# EAGLE design Mozard (EAGLE 9.1.1)
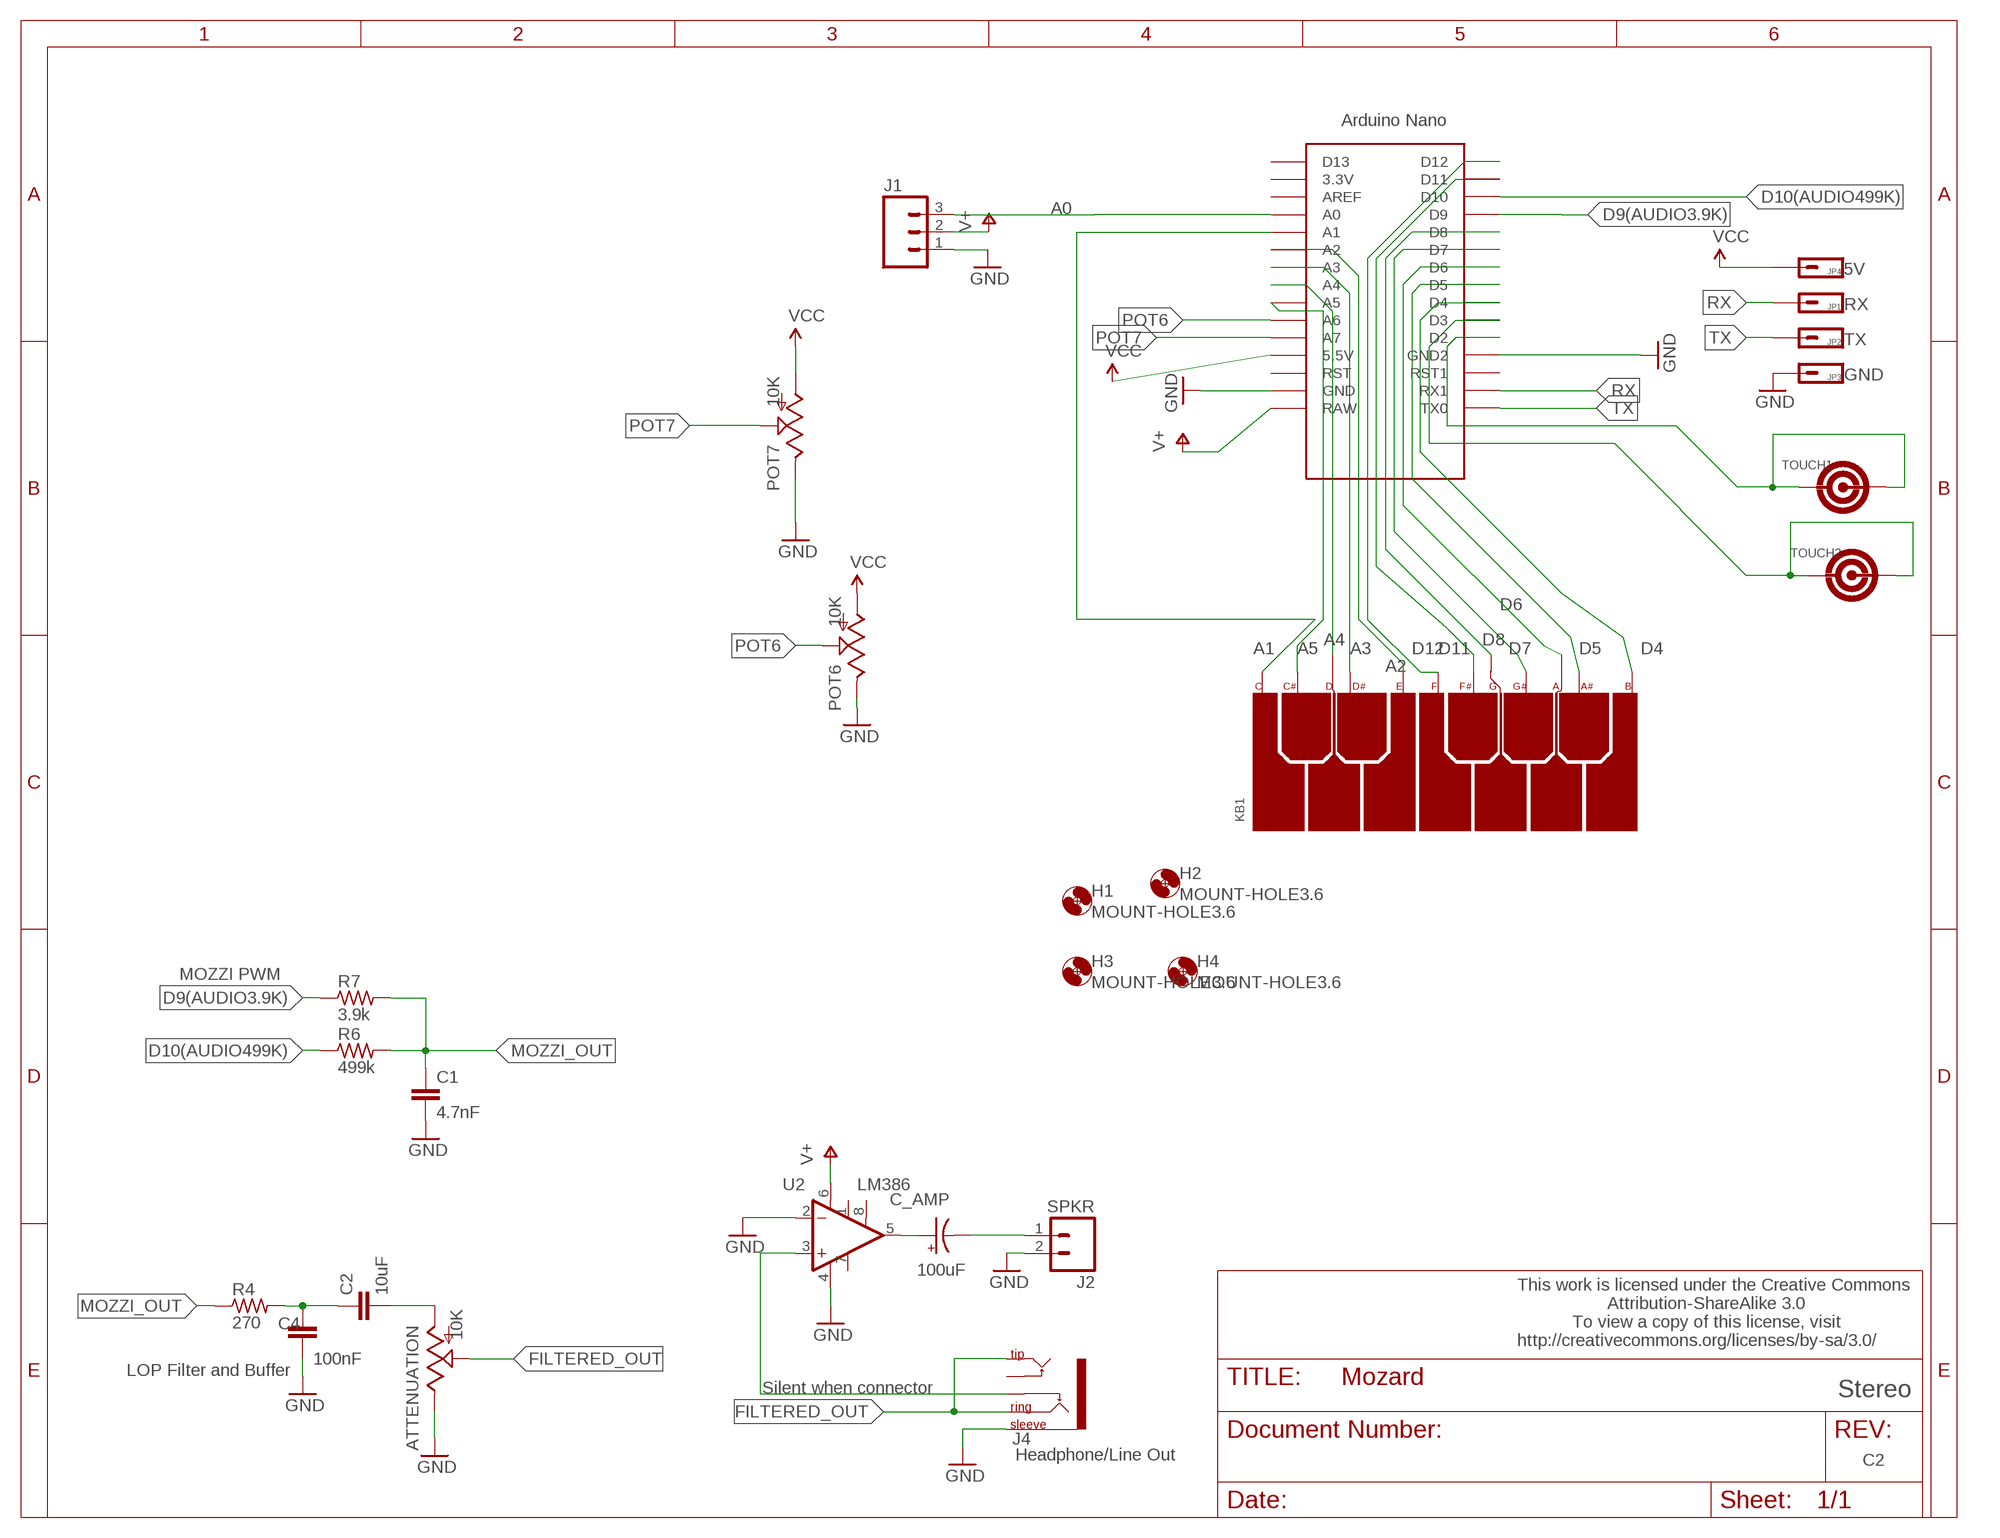
[diagram p0: schematic, sheet 1]

## Parts
ATTENUATION  10K  POTALPS-KIT  [ALPS_POT_KIT]
C1  4.7nF  0.1UF-50V-20%(PTH)KIT-EZ  [CAP-PTH-SMALL-KIT]
C2  10uF  0.1UF-50V-20%(PTH)KIT-EZ  [CAP-PTH-SMALL-KIT]
C4  100nF  0.1UF-50V-20%(PTH)KIT-EZ  [CAP-PTH-SMALL-KIT]
C_AMP  100uF  CPOL-RADIAL-10UF-25V  [CPOL-RADIAL-10UF-25V]
H1  MOUNT-HOLE3.6  [3,6]
H2  MOUNT-HOLE3.6  [3,6]
H3  MOUNT-HOLE3.6  [3,6]
H4  MOUNT-HOLE3.6  [3,6]
J1  M03SCREW  [SCREWTERMINAL-3.5MM-3]
J2  SPKR  M023.5MM  [SCREWTERMINAL-3.5MM-2]
J4  Headphone/Line Out  AUDIO-JACKPTH  [AUDIO-JACK]
JP1  RX  HEADER-1X1  [1X01_SIDE_NAME]
JP2  TX  HEADER-1X1  [1X01_SIDE_NAME]
JP3  GND  HEADER-1X1  [1X01_SIDE_NAME]
JP4  5V  HEADER-1X1  [1X01_SIDE_NAME]
KB1  PCB-KEYBOARD4  [PCB-KEYBOARD4]
POT6  10K  POTALPS-KIT  [ALPS_POT_KIT]
POT7  10K  POTALPS-KIT  [ALPS_POT_KIT]
R4  270  R-US_0204/7  [0204/7]
R6  499k  R-US_0204/7  [0204/7]
R7  3.9k  R-US_0204/7  [0204/7]
TOUCH1  PCB-TOUCHPAD2  [PCB-TOUCHPAD2]
TOUCH2  PCB-TOUCHPAD2  [PCB-TOUCHPAD2]
U2  LM386  [DIP08]
U$1  NANO  [NANO]

## Nets
A0: J1.3 U$1.A0
A1: KB1.C U$1.A1
A2: KB1.E U$1.A2
A3: KB1.D# U$1.A3
A4: KB1.D U$1.A4
A5: KB1.C# U$1.A5
D4: KB1.B U$1.D4
D5: KB1.A# U$1.D5
D6: KB1.A U$1.D6
D7: KB1.G# U$1.D7
D8: KB1.G U$1.D8
D9(AUDIO3.9K): R7.1 U$1.D9
D10(AUDIO499K): R6.1 U$1.D10
D11: KB1.F# U$1.D11
D12: KB1.F U$1.D12
FILTERED_OUT: ATTENUATION.P$2(S) J4.RING J4.TIP
GND: ATTENUATION.P$1(E) C1.2 C4.2 J1.1 J2.2 J4.SLEEVE JP3.1 POT6.P$1(E) POT7.P$1(E) U2.2(-IN) U2.4(V-) U$1.GND U$1.GND1(GND2)
MOZZI_OUT: C1.1 R4.1 R6.2 R7.2
N$1: C_AMP.- J2.1
N$2: ATTENUATION.P$3(A) C2.2
N$4: C2.1 C4.1 R4.2
N$6: J4.RSH U2.3(+IN)
N$7: C_AMP.+ U2.5(OUT)
POT6: POT6.P$2(S) U$1.A6
POT7: POT7.P$2(S) U$1.A7
RX: JP1.1 U$1.RX1
TOUCH_A: TOUCH1.1 TOUCH1.2 U$1.D2
TOUCH_B: TOUCH2.1 TOUCH2.2 U$1.D3
TX: JP2.1 U$1.TX0
V+: J1.2 U2.6(V+) U$1.RAW
VCC: JP4.1 POT6.P$3(A) POT7.P$3(A) U$1.5V(5.5V)
Unconnected: J4.TSH U2.1(GAIN) U2.7(BP) U2.8(GAIN) U$1.3.3V U$1.AREF U$1.D13 U$1.RST U$1.RST1

## Notes on the sheet
- MOZZI PWM
- This work is licensed under the Creative Commons
                    Attribution-ShareAlike 3.0
             To view a copy of this license, visit
  http://creativecommons.org/licenses/by-sa/3.0/
- LOP Filter and Buffer
- Silent when connector | Stereo
- C2

## Library data of the parts
ATTENUATION POT6 POT7 = SparkFun-Electromechanical:POT; PROD_ID: RES-09177
C1 C2 C4 = SparkFun-Capacitors:0.1UF-50V-20%(PTH): CAP-08370; PROD_ID: CAP-08370
C_AMP = Mitch-parts:CPOL-RADIAL-10UF-25V: Electrolytic Polarized
H1-H4 = holes:MOUNT-HOLE: MOUNTING HOLE with drill center marker
J1 = SparkFun-Connectors:M03: Header 3 Standard 3-pin 0.1" header. Use with straight break away headers (SKU : PRT-00116), right angle break away headers (PRT-00553), swiss pins (PRT-00743), machine pins (PRT-00117), and female headers (PRT-00115). Molex polarized connector foot print use with SKU : PRT-08232 with associated crimp pins and housings.; PROD_ID: CONN-08288
J2 = SparkFun-Connectors:M02: Standard 2-pin 0.1" header. Use with - straight break away headers ( PRT-00116) - right angle break away headers (PRT-00553) - swiss pins (PRT-00743) - machine pins (PRT-00117) - female headers (PRT-00115) Molex polarized connector foot print use with: PRT-08233 with associated crimp pins and housings. 2.54_SCREWTERM for use with PRT-10571. 3.5mm Screw Terminal footprints for PRT-08084 5mm Screw Terminal footprints for use with PRT-08432; PROD_ID: CONN-08399
J4 = TOF:AUDIO-JACK: Stereo audio jack with bypass switches. SMT version used on LilyPad MP3 board.; PROD_ID: CONN-08774
JP1-JP4 = TOF:HEADER-1X1: Header 1 Standard 1-pin 0.1" header. Use with straight break away headers (SKU : PRT-00116), right angle break away headers (PRT-00553), swiss pins (PRT-00743), machine pins (PRT-00117), and female headers (PRT-00115).
KB1 = Mitch-parts:PCB-KEYBOARD4: 1-octave PCB touch keyboard (without top C)
R4 R6 R7 = adafruit:R-US_: RESISTOR, American symbol
TOUCH1 TOUCH2 = TOF:PCB-TOUCHPAD2: PCB resistive Touch-pad for touch-switch
U2 = Mitch-parts:LM386: low voltage audio power amplifier
U$1 = TOF:NANO: Arduino Nano

## Board
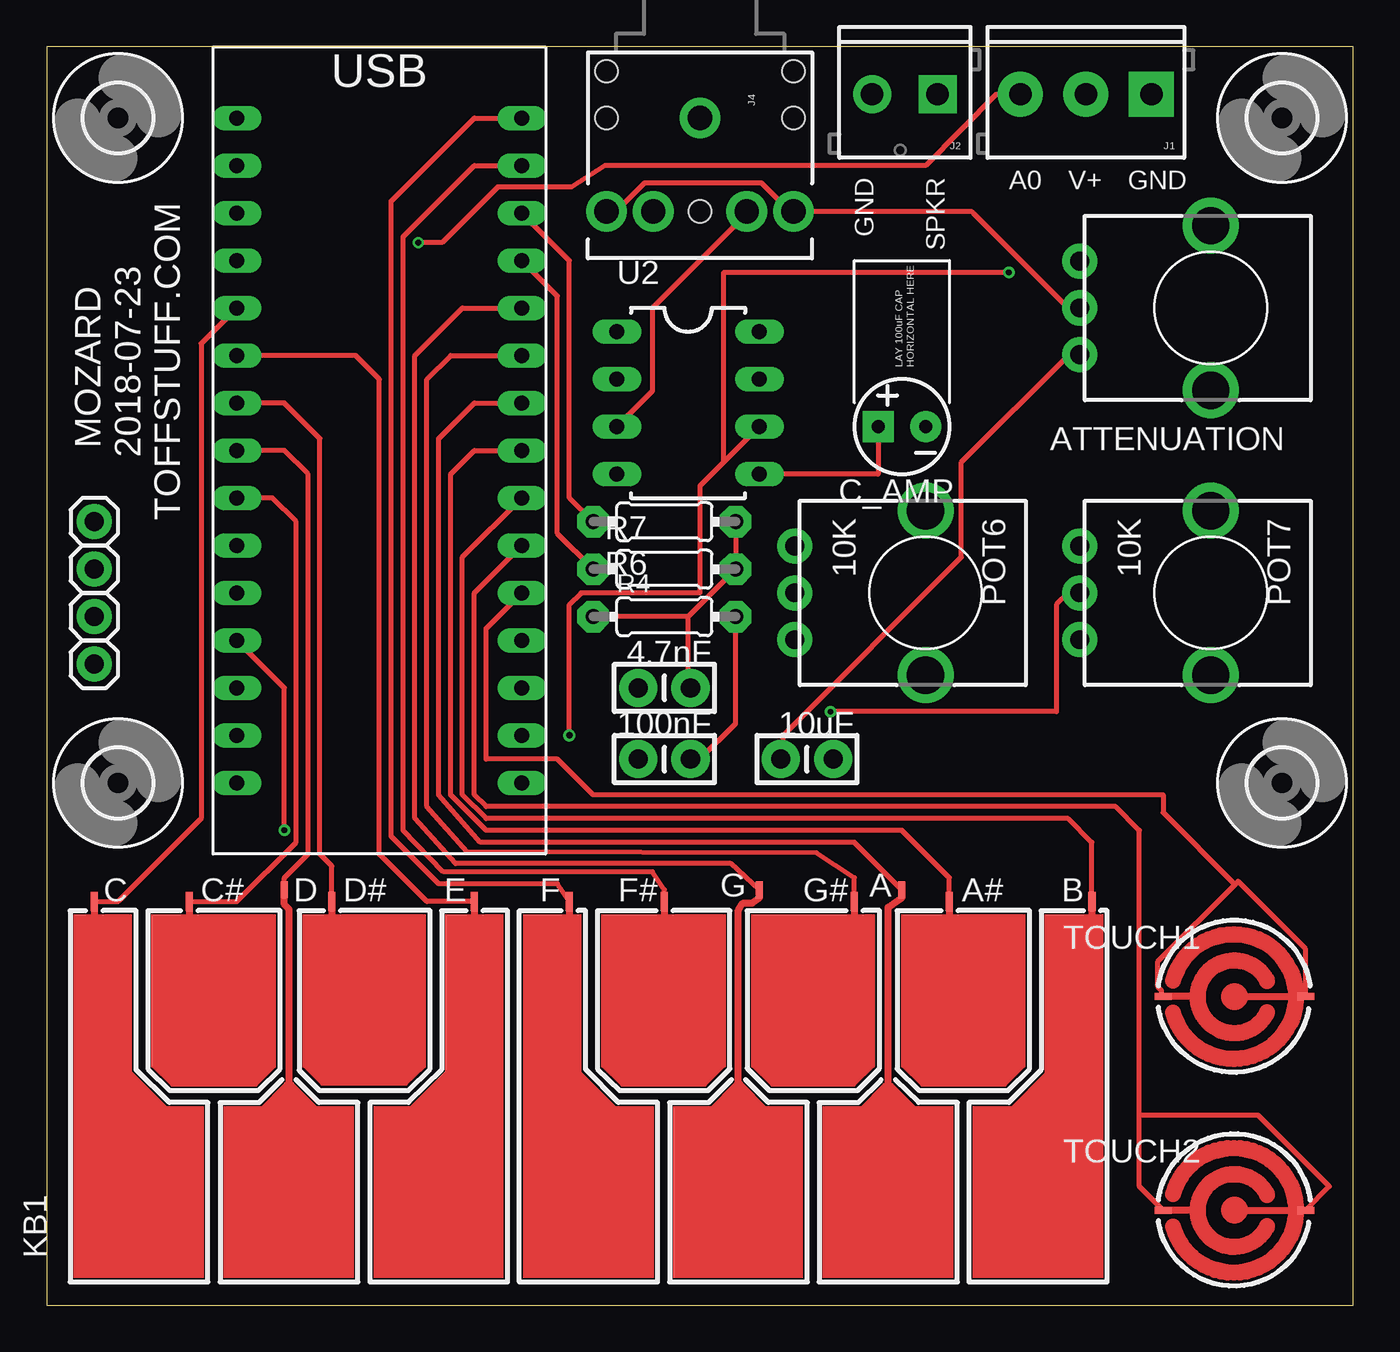
[diagram p1: board, top side]
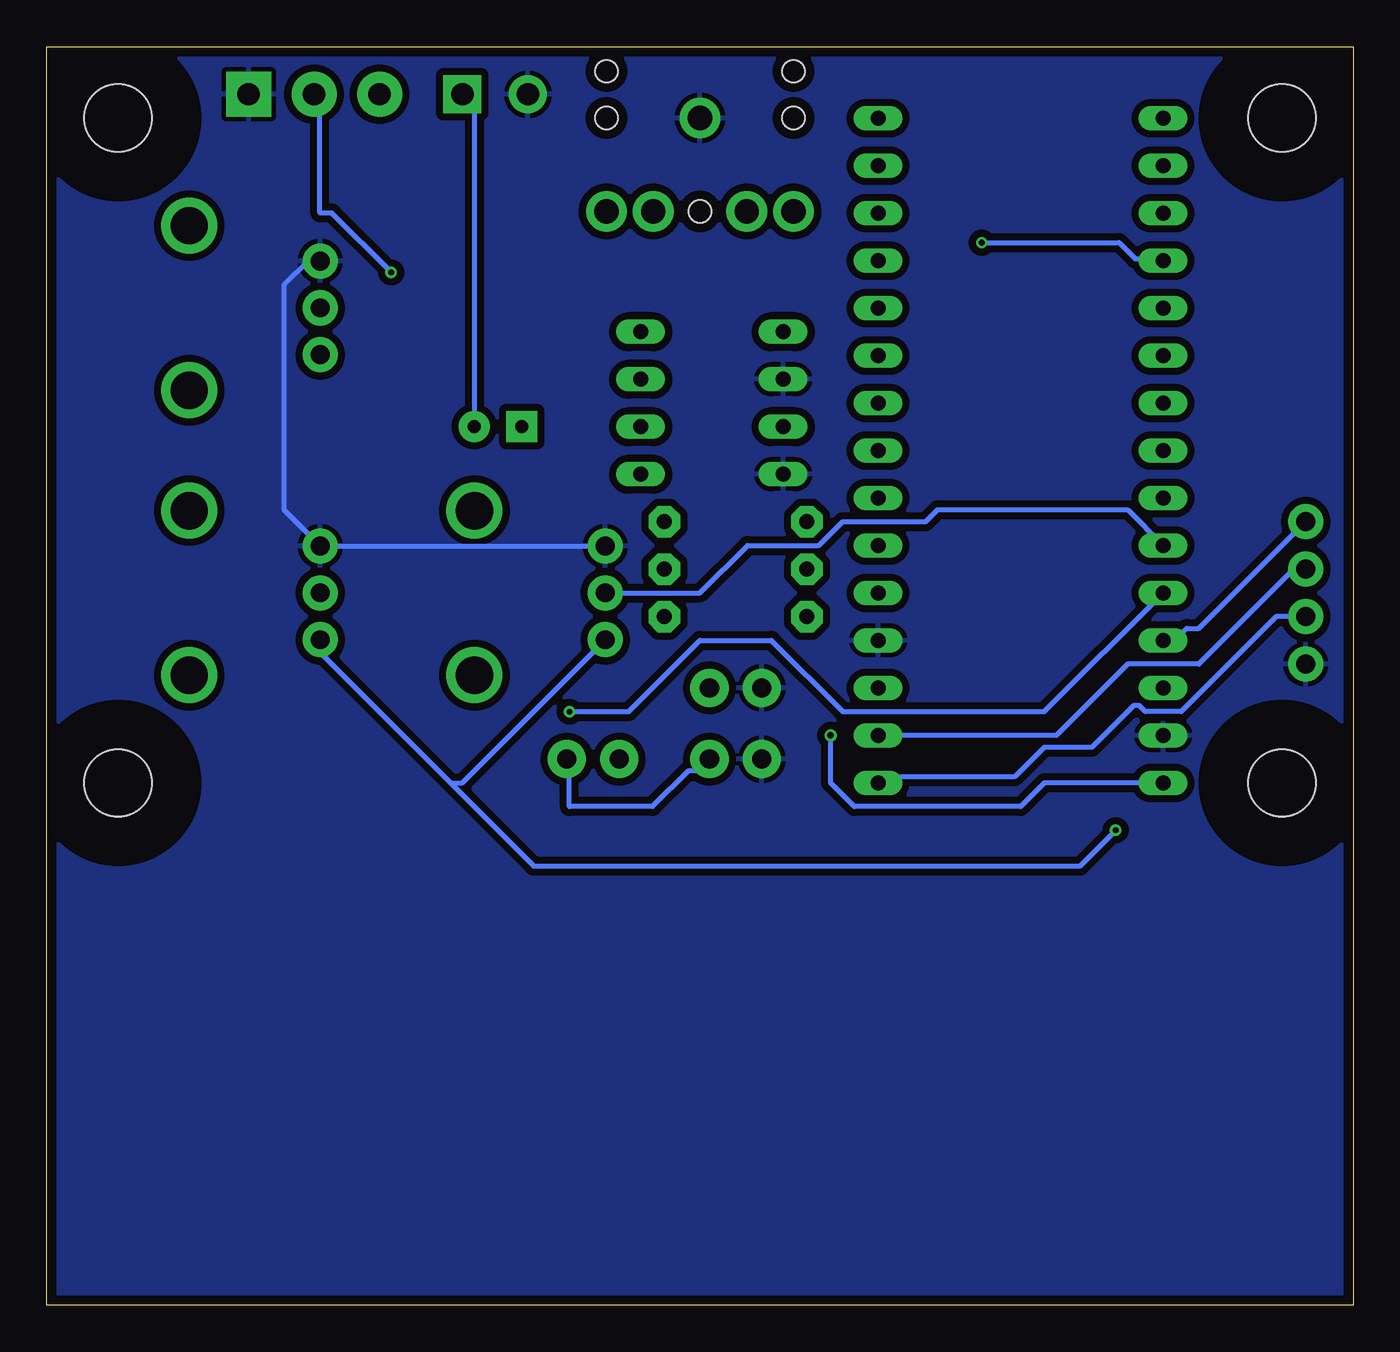
[diagram p2: board, bottom side, seen from below]

Size 69.85 x 67.31 mm. Coordinates in mm from the lower left corner, seen from the top.
Outline: 0,0 69.85,0 69.85,67.31 0,67.31 0,0
Copper layers (1*16): Top 0.035mm / dielectric 1.5mm / Bottom 0.035mm
Design rules "EagleRules *": minimum track width 10mil, minimum drill 12mil, track to track 7mil, track to pad 7mil, pad to pad 7mil, via to via 7mil, smd to smd 0mil, copper to edge 20mil, drill to drill 10mil, minimum pad ring 10mil, minimum via ring 6mil, stop-mask expansion 2mil, vias tented up to drill 25mil, thermal gap 10mil

### Footprints (pad centres in the part's own frame; a part is rotated, then mirrored left to right if it is on the bottom)
ALPS_POT_KIT = drill 1 pad 1.88: P$1 7,-2.5; P$2 7,0; P$3 7,2.5 | drill 2: P$4 0,-4.4; P$5 0,4.4
CAP-PTH-SMALL-KIT = drill 1.016 pad 2.032: 1 -1.397,0; 2 1.397,0
CPOL-RADIAL-10UF-25V = drill 0.7 pad 1.651 square: + 1.27,0 | drill 0.7 pad 1.651: - -1.27,0
3,6 = hole 3.6: 0,0
SCREWTERMINAL-3.5MM-3 = drill 1.2 pad 2.413 square: 1 0,0 | drill 1.2 pad 2.413: 2 3.5,0; 3 7,0
SCREWTERMINAL-3.5MM-2 = drill 1.2 pad 2.032 square: 1 0,0 | drill 1.2 pad 2.032: 2 3.5,0
AUDIO-JACK = drill 1.3 pad 2.184: RING 5,5; RSH 5,2.5; SLEEVE 0,0; TIP 5,-5; TSH 5,-2.5 | hole 1.2: 0,5; -2.5,5; -2.5,-5; 0,-5; 5,0
1X01_SIDE_NAME = drill 1.016 pad 1.88: 1 0,0
PCB-KEYBOARD4 = smd 0.381 x 0.889: A 12.7,10.795; D -20.32,10.795; G 5.08,10.795 | smd 0.381 x 1.016: A# 15.24,10.16; B 22.86,10.16; C -30.48,10.16; C# -25.4,10.16; D# -17.78,10.16; E -10.16,10.16; F -5.08,10.16; F# 0,10.16; G# 10.16,10.16
0204/7 = drill 0.813 pad 1.676 octagon: 1 -3.81,0; 2 3.81,0
PCB-TOUCHPAD2 = smd 0.889 x 0.381: 1 -3.81,0; 2 3.81,0
DIP08 = drill 0.813 long: 1 -3.81,-3.81; 2 -1.27,-3.81; 3 1.27,-3.81; 4 3.81,-3.81; 5 3.81,3.81; 6 1.27,3.81; 7 -1.27,3.81; 8 -3.81,3.81
NANO = drill 0.8 long: 3.3V -7.62,15.24; 5V -7.62,-10.16; A0 -7.62,10.16; A1 -7.62,7.62; A2 -7.62,5.08; A3 -7.62,2.54; A4 -7.62,0; A5 -7.62,-2.54; A6 -7.62,-5.08; A7 -7.62,-7.62; AREF -7.62,12.7; D2 7.62,-7.62; D3 7.62,-5.08; D4 7.62,-2.54; D5 7.62,0; D6 7.62,2.54; D7 7.62,5.08; D8 7.62,7.62; D9 7.62,10.16; D10 7.62,12.7; D11 7.62,15.24; D12 7.62,17.78; D13 -7.62,17.78; GND -7.62,-15.24; GND1 7.62,-10.16; RAW -7.62,-17.78; RST -7.62,-12.7; RST1 7.62,-12.7; RX1 7.62,-15.24; TX0 7.62,-17.78

### Placement (x,y rotation side)
ATTENUATION  62.23,53.34 180 top
C1  33.02,33.02 180 top
C2  40.64,29.21 180 top
C4  33.02,29.21 180 top
C_AMP  45.72,46.99 180 top
H1  3.81,27.94 0 top
H2  3.81,63.5 0 top
H3  66.04,27.94 0 top
H4  66.04,63.5 0 top
J1  59.05,64.77 180 top
J2  47.62,64.77 180 top
J4  34.92,63.5 270 top
JP1  2.54,39.37 0 top
JP2  2.54,36.83 0 top
JP3  2.54,34.29 0 top
JP4  2.54,41.91 0 top
KB1  33.02,11.43 0 top
POT6  46.99,38.1 180 top
POT7  62.23,38.1 180 top
R4  33.02,36.83 0 top
R6  33.02,41.91 0 top
R7  33.02,39.37 0 top
TOUCH1  63.5,16.51 0 top
TOUCH2  63.5,5.08 0 top
U2  34.29,48.26 270 top
U$1  17.78,45.72 0 top

### Tracks (layer width: path | path; a pad name or v marks a point on that pad's centre or on a via)
A0  (via drill 0.3)
  Top 0.254: J1.3 50.76,64.77 46.99,60.96 29.84,60.96 28.05,59.8 24.11,59.8 21.13,56.83 v19.86,56.83
  Bottom 0.254: v19.86,56.83 12.52,56.83 11.66,55.97 10.36,55.97 U$1.A0
A1
  Top 0.254: KB1.C 3.81,21.59 8.26,26.04 8.26,51.44 U$1.A1
A2
  Top 0.254: U$1.A2 16.51,50.8 17.78,49.53 17.78,24.13 20.32,21.59 KB1.E
A3
  Top 0.254: KB1.D# 15.24,23.5 14.61,24.13 14.61,46.35 12.7,48.26 U$1.A3
A4
  Top 0.254: KB1.D 12.7,22.86 13.97,24.13 13.97,44.45 12.7,45.72 U$1.A4
A5
  Top 0.254: U$1.A5 12.06,43.18 13.34,41.91 13.34,24.77 10.16,21.59 KB1.C#
D4
  Top 0.254: KB1.B 55.88,24.77 54.61,26.04 23.5,26.04 22.23,27.3 22.23,40.01 U$1.D4
D5
  Top 0.254: KB1.A# 48.26,22.86 45.72,25.4 23.5,25.4 21.59,27.3 21.59,44.45 22.86,45.72 U$1.D5
D6
  Top 0.254: KB1.A 43.18,24.77 23.18,24.77 20.95,27.3 20.95,46.35 22.86,48.26 U$1.D6
D7
  Top 0.254: KB1.G# 43.18,22.86 41.15,24.19 22.48,24.26 20.32,26.67 20.32,49.53 21.59,50.8 U$1.D7
D8
  Top 0.254: U$1.D8 22.23,53.34 19.68,50.8 19.68,26.04 21.84,23.62 36.58,23.62 KB1.G
D9(AUDIO3.9K)
  Top 0.254: U$1.D9 27.3,53.98 27.3,41.27 R7.1
D10(AUDIO499K)
  Top 0.254: U$1.D10 27.94,55.88 27.94,43.18 R6.1
D11
  Top 0.254: KB1.F# 33.02,22.23 32.38,23.18 21.21,23.18 19.05,25.4 19.05,57.15 22.86,60.96 U$1.D11
D12
  Top 0.254: KB1.F 27.3,22.54 20.95,22.54 18.41,25.08 18.41,59.05 22.86,63.5 U$1.D12
FILTERED_OUT
  Top 0.254: J4.TIP 30.01,58.51 30.44,58.51 31.95,60.02 38.21,60.02 39.73,58.51 J4.RING 39.94,58.51 49.44,58.51 49.53,58.42 54.61,53.34 ATTENUATION.P$2
GND
  Bottom 0.254: POT6.P$1 POT7.P$1 57.15,42.52 57.15,54.61 55.88,55.88 55.27,55.88 ATTENUATION.P$1
  pour Bottom (isolate 0.381): 0,67.31 69.85,67.31 69.85,0 0,0
MOZZI_OUT
  Top 0.254: R6.2 R7.2 34.29,36.83 | 34.29,36.83 R4.1 | 34.29,36.83 34.29,33.02 C1.1
N$1
  Bottom 0.254: C_AMP.- 46.99,64.77 J2.1
N$2
  Top 0.254: ATTENUATION.P$3 54.61,50.8 48.9,45.09 48.9,40.01 39.37,30.48 39.37,29.21 C2.2
N$4
  Top 0.254: R4.2 36.83,31.11 34.92,29.21 C4.1
  Bottom 0.254: C2.1 41.91,29.21 41.91,26.67 37.47,26.67 35.56,28.57 34.92,28.57 34.29,29.21 C4.1
N$6
  Top 0.254: U2.3 32.38,48.9 32.38,49.01 32.38,53.33 37.35,58.29 J4.RSH
N$7
  Top 0.254: U2.5 44.45,44.45 C_AMP.+
POT6
  Bottom 0.254: POT6.P$2 34.92,38.1 32.38,40.64 28.57,40.64 27.3,41.91 22.86,41.91 22.23,42.55 12.06,42.55 U$1.A6
POT7  (via drill 0.3)
  Top 0.254: v41.91,31.75 53.98,31.75 53.98,37.47 54.61,38.1 POT7.P$2
  Bottom 0.254: U$1.A7 16.51,31.75 27.3,31.75 31.11,35.56 34.92,35.56 38.73,31.75 v41.91,31.75
RX
  Bottom 0.254: U$1.RX1 15.88,30.48 12.06,34.29 8.26,34.29 3.17,39.37 JP1.1
TOUCH_A
  Top 0.254: TOUCH1.2 67.31,19.05 63.69,22.67 63.53,22.51 | U$1.D2 23.5,36.2 23.5,29.21 27.3,29.21 29.21,27.3 59.69,27.3 59.69,26.35 63.5,22.54 63.53,22.51 | TOUCH1.1 59.59,16.62 59.59,16.84 59.37,17.06 59.37,18.35 63.53,22.51
TOUCH_B
  Top 0.254: TOUCH2.1 58.42,6.35 58.42,10.16 | 58.42,10.16 58.42,25.4 57.15,26.67 23.5,26.67 22.86,27.3 22.86,38.1 U$1.D3 | TOUCH2.2 68.58,6.35 64.77,10.16 58.42,10.16
TX
  Bottom 0.254: U$1.TX0 25.08,28.26 18.1,28.26 16.51,29.84 13.97,29.84 11.75,32.07 11.43,32.07 11.11,31.75 9.21,31.75 4.13,36.83 JP2.1
V+  (via drill 0.3, 0.35)
  Top 0.254: U2.6 36.2,45.09 | 36.2,45.09 34.92,43.81 34.92,38.1 28.57,38.1 27.94,37.47 v27.94,30.48 | v51.44,55.24 36.2,55.24 36.2,45.09
  Bottom 0.254: v51.44,55.24 54.61,58.42 55.24,58.42 55.24,64.77 J1.2 | U$1.RAW 16.51,27.94 17.78,26.67 26.67,26.67 27.94,27.94 v27.94,30.48
VCC  (via drill 0.3)
  Top 0.254: U$1.5V 12.7,33.02 v12.7,25.4
  Bottom 0.254: v12.7,25.4 14.61,23.5 43.81,23.5 48.26,27.94 | 48.26,27.94 55.24,34.92 55.24,35.56 POT7.P$3 | 48.26,27.94 47.62,27.94 40.01,35.56 POT6.P$3 | JP4.1 8.26,36.2 8.89,36.2 9.53,35.56 U$1.5V

### Text on the board
tPlace: GND | SPKR | A0 | V+ | GND | MOZARD / 2018-07-23 / TOFFSTUFF.COM | LAY 100uF CAP / HORIZONTAL HERE